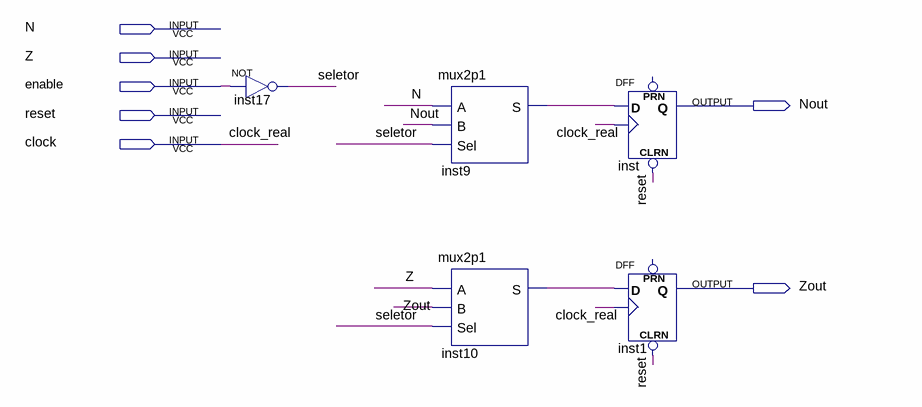
[diagram p0: schematic sheet]
// Quartus schematic flag_register.bdf as structural Verilog: 5 symbols, 7 pins
module flag_register (
  input  N,
  input  Z,
  input  enable,
  input  reset,
  input  clock,
  output Nout,
  output Zout
);

  wire inst9_s, inst10_s, seletor;

  not inst17 (seletor, enable);
  mux2p1 inst9 (.A(N), .B(Nout), .Sel(seletor), .S(inst9_s));
  mux2p1 inst10 (.A(Z), .B(Zout), .Sel(seletor), .S(inst10_s));
  DFF inst (.CLRN(reset), .CLK(clock), .D(inst9_s), .Q(Nout));  // open: PRN
  DFF inst1 (.CLRN(reset), .CLK(clock), .D(inst10_s), .Q(Zout));  // open: PRN

  // Other names for the same wires on the sheet: clock_real = clock
endmodule
